# EAGLE design 05_ALU_OUT (EAGLE 7.5.0)
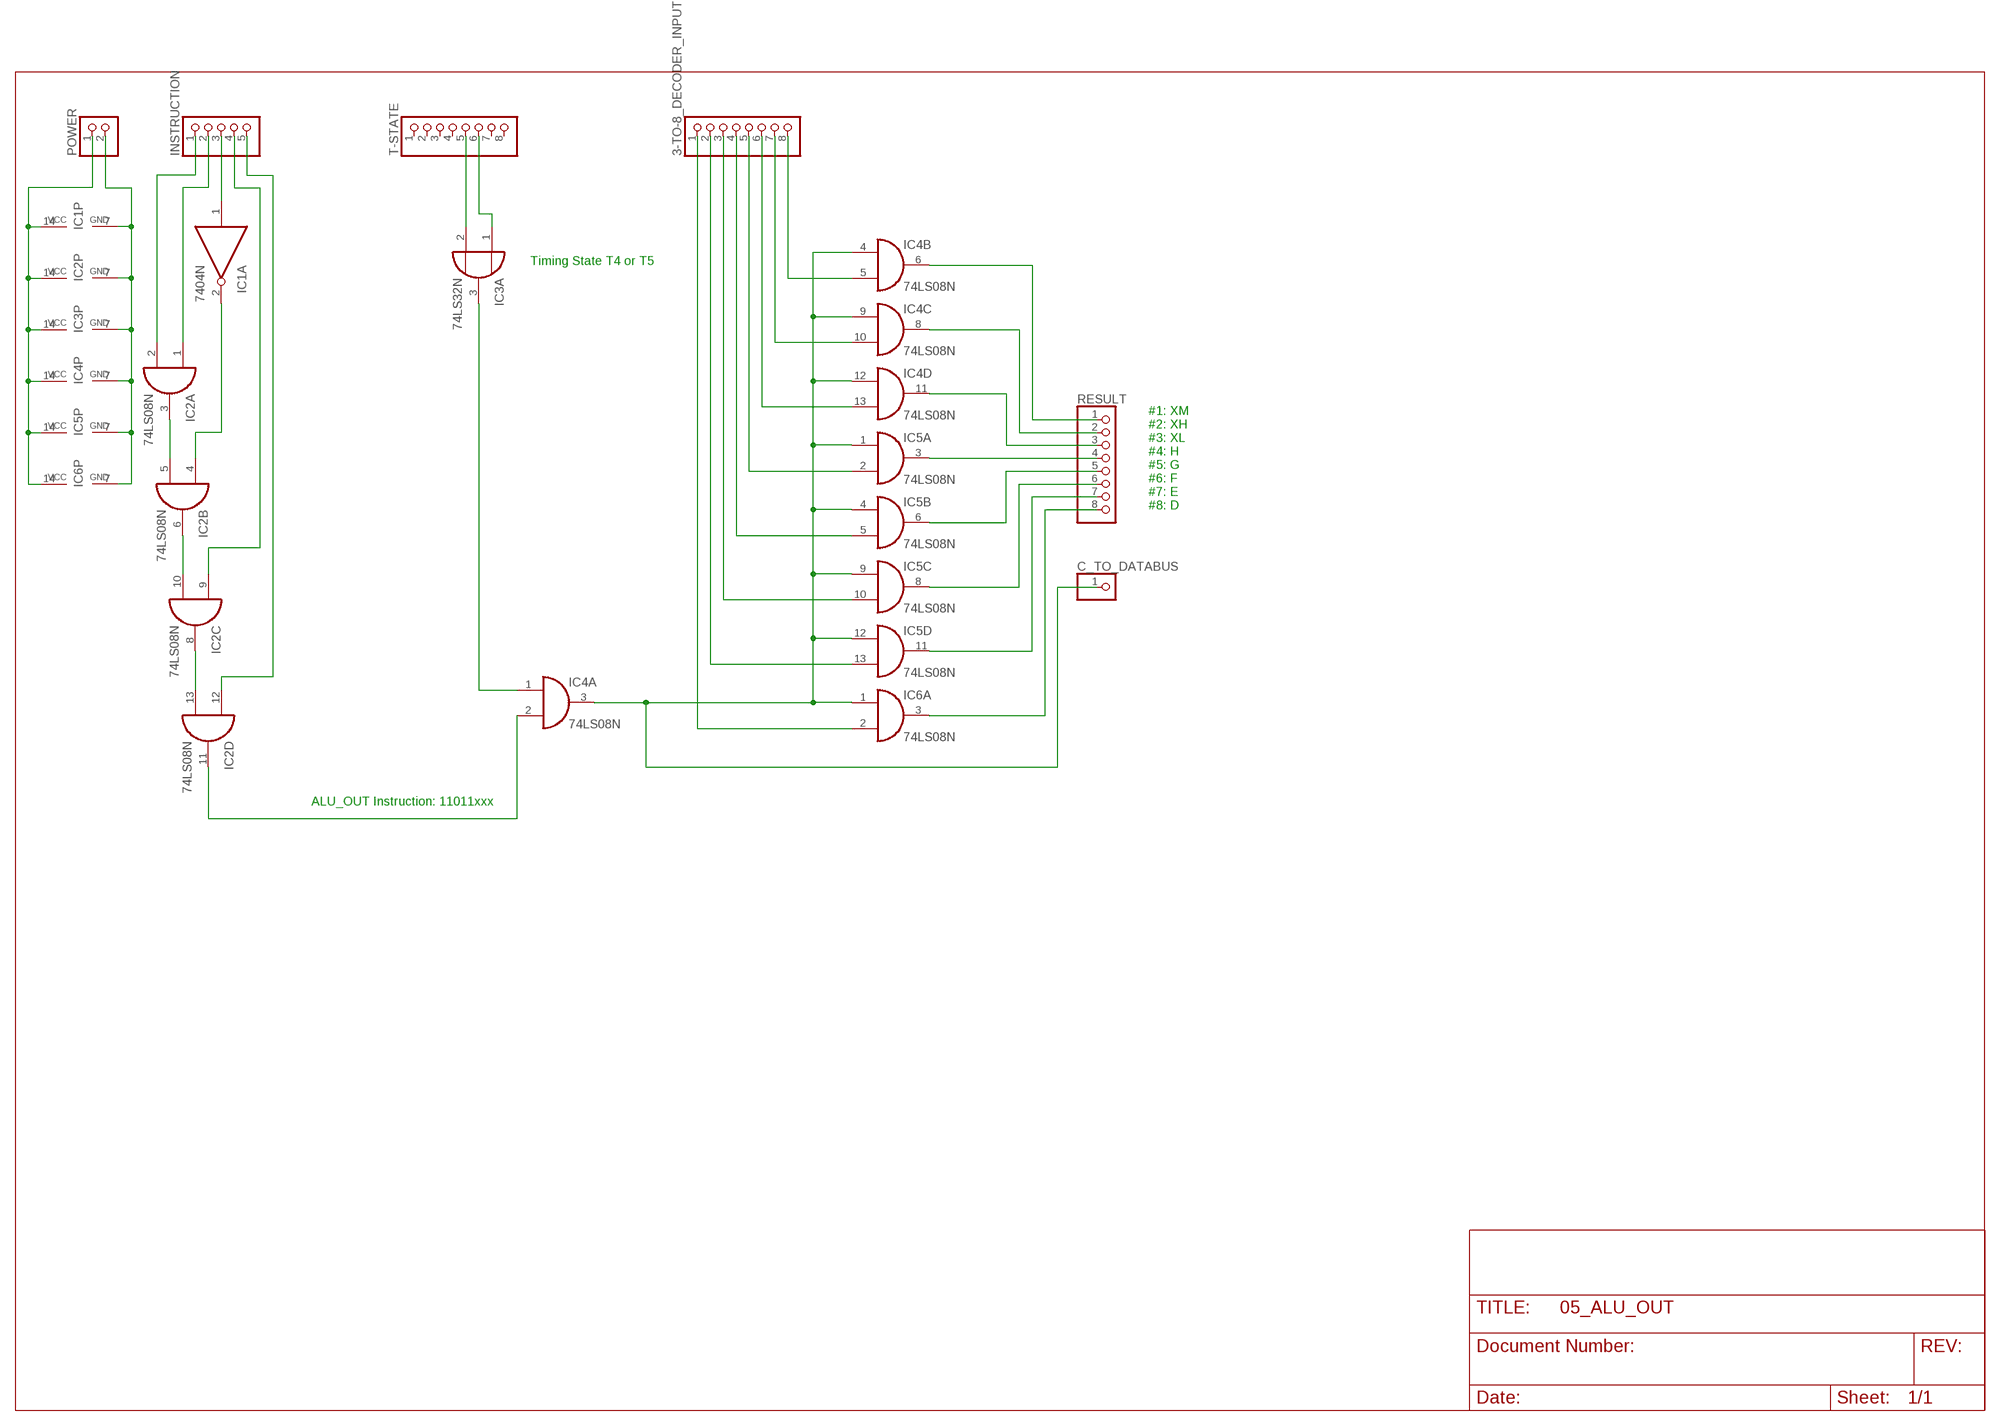
[diagram p0: schematic, sheet 1]

## Parts
3-TO-8_DECODER_INPUT  PINHD-1X8  [1X08]
C_TO_DATABUS  PINHD-1X1  [1X01]
IC1  7404N  [DIL14]
IC2  74LS08N  [DIL14]
IC3  74LS32N  [DIL14]
IC4  74LS08N  [DIL14]
IC5  74LS08N  [DIL14]
IC6  74LS08N  [DIL14]
INSTRUCTION  PINHD-1X5  [1X05]
POWER  PINHD-1X2  [1X02]
RESULT  PINHD-1X8  [1X08]
T-STATE  PINHD-1X8  [1X08]

## Nets
GND: IC1.7(P:GND) IC2.7(P:GND) IC3.7(P:GND) IC4.7(P:GND) IC5.7(P:GND) IC6.7(P:GND) POWER.2
N$1: IC1.1(A:I) INSTRUCTION.3
N$2: IC2.2(A:I1) INSTRUCTION.1
N$3: IC2.1(A:I0) INSTRUCTION.2
N$4: IC2.3(A:O) IC2.5(B:I1)
N$5: IC1.2(A:O) IC2.4(B:I0)
N$6: IC2.6(B:O) IC2.10(C:I1)
N$7: IC2.9(C:I0) INSTRUCTION.4
N$8: IC2.8(C:O) IC2.13(D:I1)
N$9: IC2.12(D:I0) INSTRUCTION.5
N$10: IC2.11(D:O) IC4.2(A:I1)
N$11: IC3.2(A:I1) T-STATE.5
N$12: IC3.1(A:I0) T-STATE.6
N$13: IC3.3(A:O) IC4.1(A:I0)
N$14: C_TO_DATABUS.1 IC4.3(A:O) IC4.4(B:I0) IC4.9(C:I0) IC4.12(D:I0) IC5.1(A:I0) IC5.4(B:I0) IC5.9(C:I0) IC5.12(D:I0) IC6.1(A:I0)
N$15: 3-TO-8_DECODER_INPUT.8 IC4.5(B:I1)
N$16: 3-TO-8_DECODER_INPUT.7 IC4.10(C:I1)
N$17: 3-TO-8_DECODER_INPUT.6 IC4.13(D:I1)
N$18: 3-TO-8_DECODER_INPUT.5 IC5.2(A:I1)
N$19: 3-TO-8_DECODER_INPUT.4 IC5.5(B:I1)
N$20: 3-TO-8_DECODER_INPUT.3 IC5.10(C:I1)
N$21: 3-TO-8_DECODER_INPUT.2 IC5.13(D:I1)
N$22: 3-TO-8_DECODER_INPUT.1 IC6.2(A:I1)
N$23: IC4.6(B:O) RESULT.1
N$24: IC4.8(C:O) RESULT.2
N$25: IC4.11(D:O) RESULT.3
N$26: IC5.3(A:O) RESULT.4
N$27: IC5.6(B:O) RESULT.5
N$28: IC5.8(C:O) RESULT.6
N$29: IC5.11(D:O) RESULT.7
N$30: IC6.3(A:O) RESULT.8
VCC: IC1.14(P:VCC) IC2.14(P:VCC) IC3.14(P:VCC) IC4.14(P:VCC) IC5.14(P:VCC) IC6.14(P:VCC) POWER.1
Unconnected: IC1.3(B:I) IC1.4(B:O) IC1.5(C:I) IC1.6(C:O) IC1.8(D:O) IC1.9(D:I) IC1.10(E:O) IC1.11(E:I) IC1.12(F:O) IC1.13(F:I) IC3.4(B:I0) IC3.5(B:I1) IC3.6(B:O) IC3.8(C:O) IC3.9(C:I0) IC3.10(C:I1) IC3.11(D:O) IC3.12(D:I0) IC3.13(D:I1) IC6.4(B:I0) IC6.5(B:I1) IC6.6(B:O) IC6.8(C:O) IC6.9(C:I0) IC6.10(C:I1) IC6.11(D:O) IC6.12(D:I0) IC6.13(D:I1) T-STATE.1 T-STATE.2 T-STATE.3 T-STATE.4 T-STATE.7 T-STATE.8

## Notes on the sheet
- Timing State T4 or T5
- #1: XM
  #2: XH
  #3: XL
  #4: H
  #5: G
  #6: F
  #7: E
  #8: D
- ALU_OUT Instruction: 11011xxx

## Library data of the parts
3-TO-8_DECODER_INPUT RESULT T-STATE = pinhead:PINHD-1X8: PIN HEADER
C_TO_DATABUS = pinhead:PINHD-1X1: PIN HEADER
IC1 = 74xx-eu:74*04: Hex INVERTER
IC2 IC4-IC6 = 74xx-eu:74*08: Quad 2-input AND gate
IC3 = 74xx-eu:74*32: Quad 2-input OR gate
INSTRUCTION = pinhead:PINHD-1X5: PIN HEADER
POWER = pinhead:PINHD-1X2: PIN HEADER

## Board
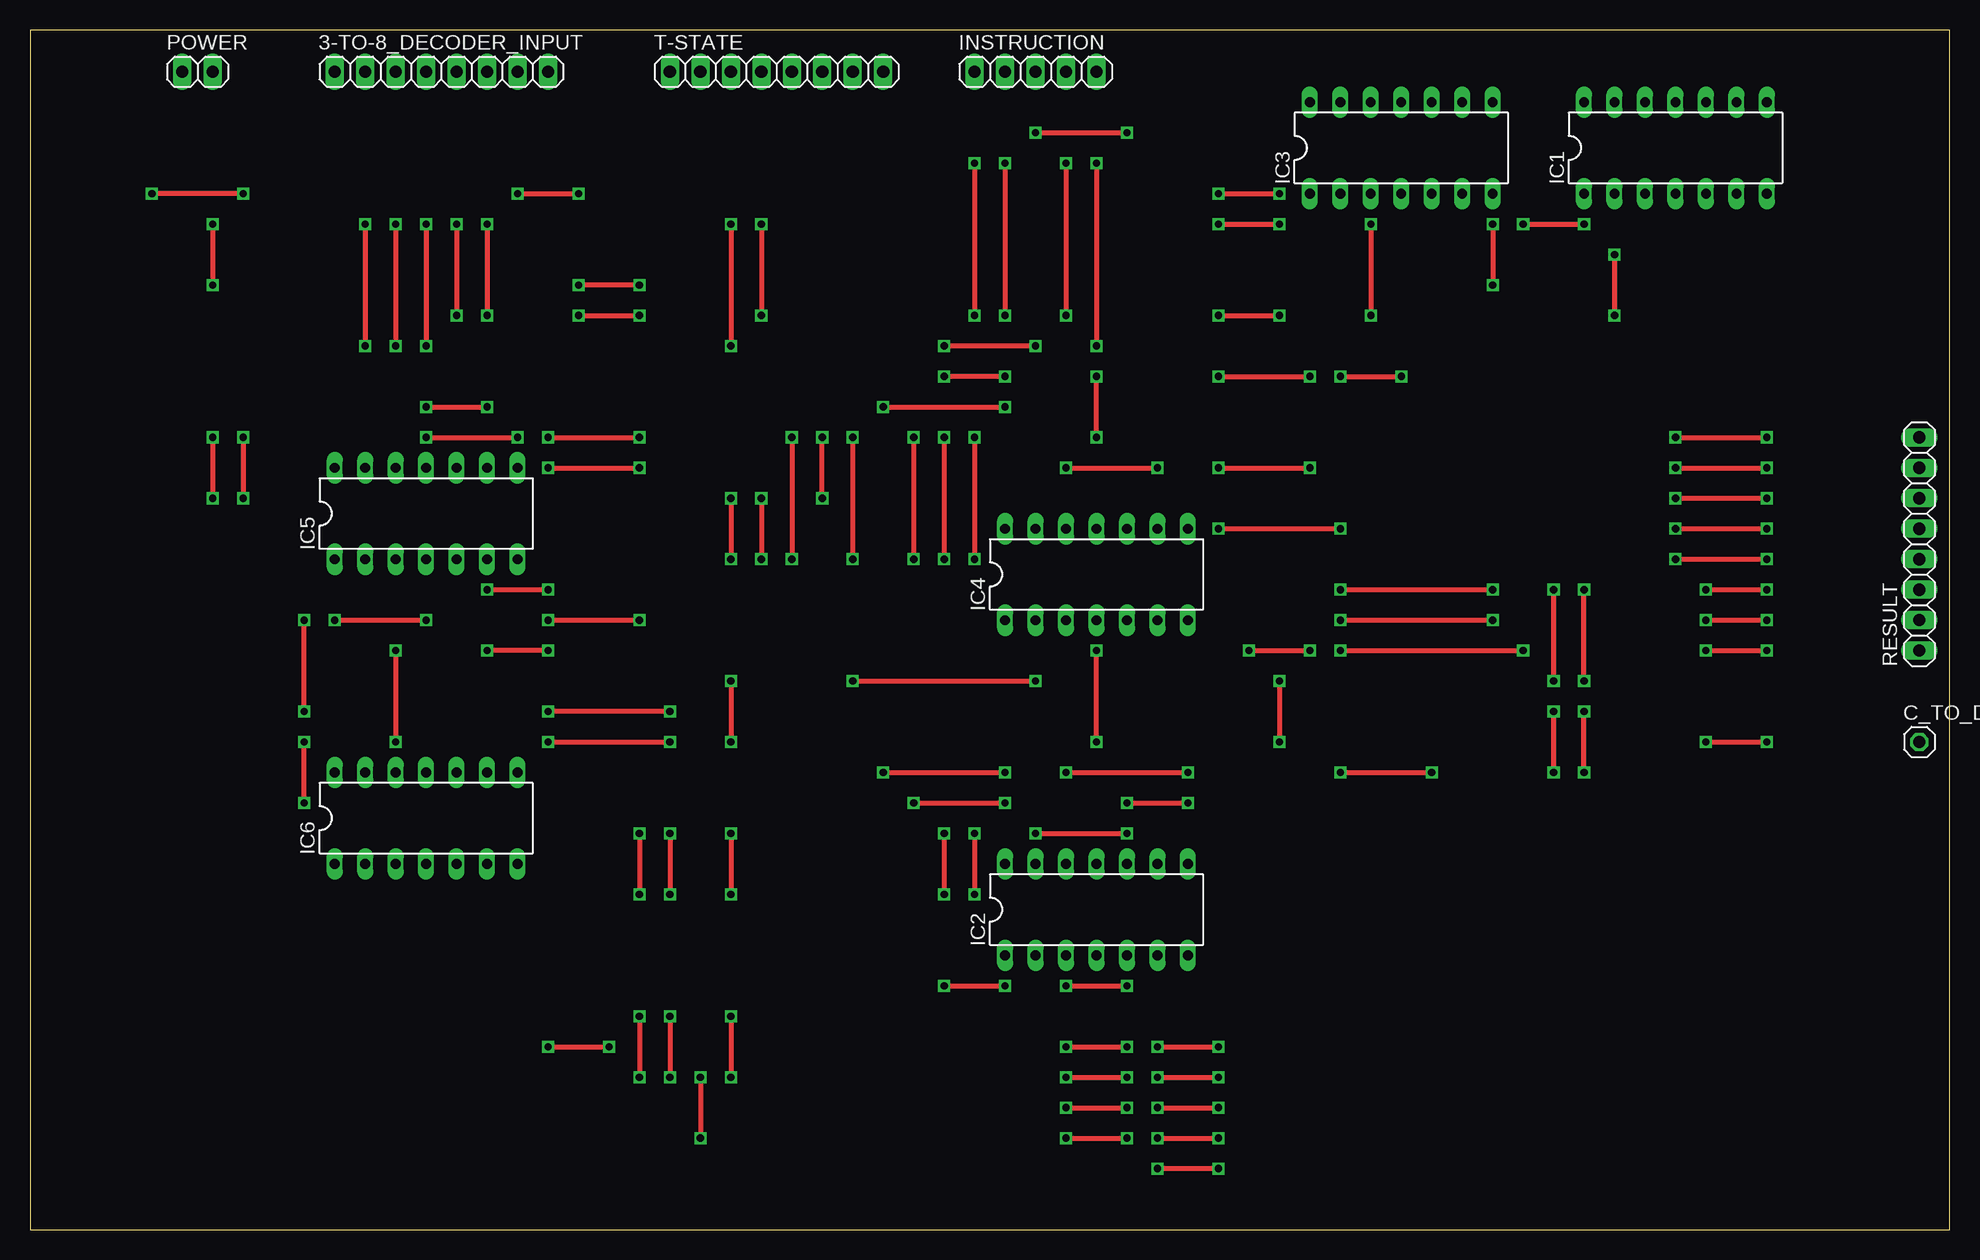
[diagram p1: board, top side]
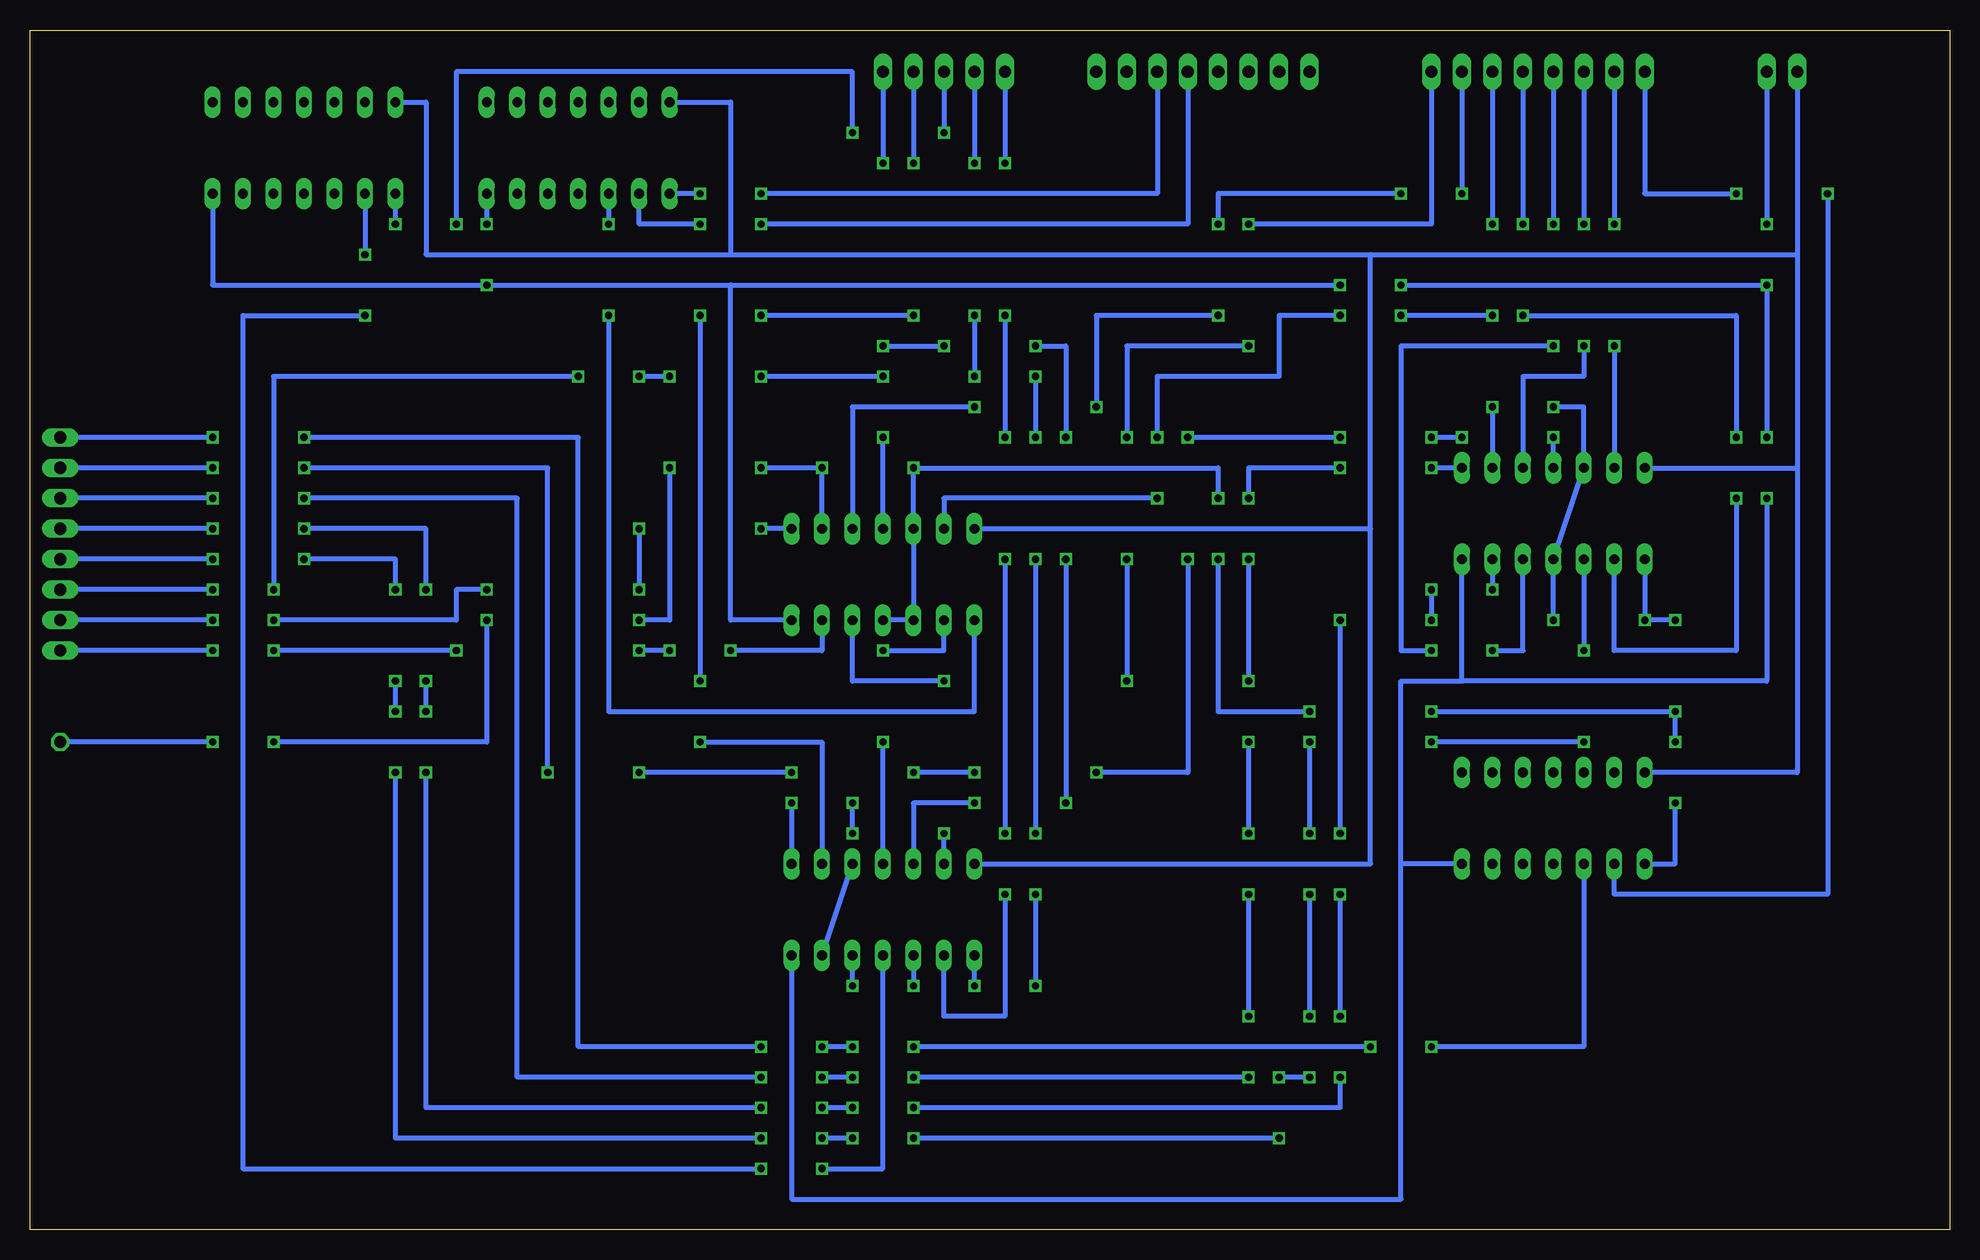
[diagram p2: board, bottom side, seen from below]

Size 160 x 100 mm. Coordinates in mm from the lower left corner, seen from the top.
Outline: 0,0 160,0 160,100 0,100 0,0
Copper layers (1*16): Top 0.035mm / dielectric 1.5mm / Bottom 0.035mm
Design rules "default": minimum track width 10mil, minimum drill 24mil, track to track 8mil, track to pad 8mil, pad to pad 8mil, via to via 8mil, smd to smd 8mil, copper to edge 40mil, drill to drill 8mil, minimum pad ring 10mil, minimum via ring 8mil, stop-mask expansion 4mil, vias tented up to drill 0mil, thermal gap 10mil

### Footprints (pad centres in the part's own frame; a part is rotated, then mirrored left to right if it is on the bottom)
1X08 = drill 1.016 long: 1 -8.89,0; 2 -6.35,0; 3 -3.81,0; 4 -1.27,0; 5 1.27,0; 6 3.81,0; 7 6.35,0; 8 8.89,0
1X01 = drill 1.016 octagon: 1 0,0
DIL14 = drill 0.813 long: 1 -7.62,-3.81; 2 -5.08,-3.81; 3 -2.54,-3.81; 4 0,-3.81; 5 2.54,-3.81; 6 5.08,-3.81; 7 7.62,-3.81; 8 7.62,3.81; 9 5.08,3.81; 10 2.54,3.81; 11 0,3.81; 12 -2.54,3.81; 13 -5.08,3.81; 14 -7.62,3.81
1X05 = drill 1.016 long: 1 -5.08,0; 2 -2.54,0; 3 0,0; 4 2.54,0; 5 5.08,0
1X02 = drill 1.016 long: 1 -1.27,0; 2 1.27,0

### Placement (x,y rotation side)
3-TO-8_DECODER_INPUT  34.29,96.52 0 top
C_TO_DATABUS  157.48,40.64 0 top
IC1  137.16,90.17 0 top
IC2  88.9,26.67 0 top
IC3  114.3,90.17 0 top
IC4  88.9,54.61 0 top
IC5  33.02,59.69 0 top
IC6  33.02,34.29 0 top
INSTRUCTION  83.82,96.52 0 top
POWER  13.97,96.52 0 top
RESULT  157.48,57.15 90 top
T-STATE  62.23,96.52 0 top

### Tracks (layer width: path | path; a pad name or v marks a point on that pad's centre or on a via)
GND  (via drill 0.6)
  Top 0.406: v15.24,83.82 v15.24,78.74 | v15.24,66.04 v15.24,60.96 | v121.92,83.82 v121.92,78.74 | v50.8,78.74 v45.72,78.74
  Bottom 0.406: POWER.2 v15.24,83.82 | v15.24,66.04 v15.24,78.74 v45.72,78.74 | v15.24,60.96 15.24,45.72 40.64,45.72 | 40.64,45.72 IC5.7 | IC6.7 45.72,30.48 | 45.72,30.48 45.72,45.72 40.64,45.72 | IC2.7 96.52,2.54 45.72,2.54 45.72,30.48 | IC3.7 v121.92,83.82 | 101.6,78.74 v121.92,78.74 144.78,78.74 IC1.7 | 101.6,78.74 v50.8,78.74 | IC4.7 101.6,50.8 101.6,78.74
N$1  (via drill 0.6)
  Top 0.406: v83.82,91.44 v91.44,91.44 | v124.46,83.82 v129.54,83.82
  Bottom 0.406: INSTRUCTION.3 v83.82,91.44 | v91.44,91.44 91.44,96.52 124.46,96.52 v124.46,83.82 | v129.54,83.82 IC1.1
N$2  (via drill 0.6)
  Top 0.406: v78.74,88.9 v78.74,76.2 | v78.74,66.04 v78.74,55.88 | v78.74,33.02 v78.74,27.94
  Bottom 0.406: INSTRUCTION.1 v78.74,88.9 | v78.74,76.2 v78.74,66.04 | v78.74,55.88 v78.74,33.02 | v78.74,27.94 78.74,17.78 83.82,17.78 IC2.2
N$3  (via drill 0.6)
  Top 0.406: v81.28,88.9 v81.28,76.2 | v81.28,71.12 v76.2,71.12 | v76.2,66.04 v76.2,55.88 | v76.2,33.02 v76.2,27.94 | v76.2,20.32 v81.28,20.32
  Bottom 0.406: INSTRUCTION.2 v81.28,88.9 | v81.28,76.2 v81.28,71.12 | v76.2,71.12 v76.2,66.04 | v76.2,55.88 v76.2,33.02 | v76.2,27.94 v76.2,20.32 | v81.28,20.32 IC2.1
N$4  (via drill 0.6)
  Top 0.406: v86.36,20.32 v91.44,20.32
  Bottom 0.406: IC2.3 v86.36,20.32 | v91.44,20.32 IC2.5
N$5  (via drill 0.6)
  Top 0.406: v132.08,81.28 v132.08,76.2 | v99.06,5.08 v93.98,5.08
  Bottom 0.406: IC1.2 v132.08,81.28 | v99.06,5.08 142.24,5.08 142.24,76.2 v132.08,76.2 | v93.98,5.08 88.9,5.08 IC2.4
N$6
  Bottom 0.406: IC2.6 IC2.10
N$7  (via drill 0.6)
  Top 0.406: v86.36,88.9 v86.36,76.2 | v99.06,76.2 v104.14,76.2 | v104.14,45.72 v104.14,40.64
  Bottom 0.406: INSTRUCTION.4 v86.36,88.9 | v86.36,76.2 v99.06,76.2 | v104.14,76.2 v104.14,45.72 | v104.14,40.64 93.98,40.64 IC2.9
N$8  (via drill 0.6)
  Top 0.406: v83.82,33.02 v91.44,33.02 | v91.44,35.56 v96.52,35.56
  Bottom 0.406: IC2.13 v83.82,33.02 | v91.44,33.02 v91.44,35.56 | v96.52,35.56 IC2.8
N$9  (via drill 0.6)
  Top 0.406: v88.9,88.9 v88.9,73.66 | v83.82,73.66 v76.2,73.66 | v73.66,66.04 v73.66,55.88 | v73.66,35.56 v81.28,35.56
  Bottom 0.406: INSTRUCTION.5 v88.9,88.9 | v88.9,73.66 v83.82,73.66 | v76.2,73.66 73.66,73.66 v73.66,66.04 | v73.66,55.88 v73.66,35.56 | v81.28,35.56 86.36,35.56 IC2.12
N$10  (via drill 0.6)
  Top 0.406: v88.9,40.64 v88.9,48.26
  Bottom 0.406: IC2.11 v88.9,40.64 | v88.9,48.26 83.82,48.26 IC4.2
N$11  (via drill 0.6)
  Top 0.406: v99.06,83.82 v104.14,83.82
  Bottom 0.406: T-STATE.5 63.5,83.82 v99.06,83.82 | v104.14,83.82 109.22,83.82 IC3.2
N$12  (via drill 0.6)
  Top 0.406: v99.06,86.36 v104.14,86.36
  Bottom 0.406: T-STATE.6 66.04,86.36 v99.06,86.36 | v104.14,86.36 IC3.1
N$13  (via drill 0.6)
  Top 0.406: v111.76,83.82 v111.76,76.2
  Bottom 0.406: IC3.3 v111.76,83.82 | v111.76,76.2 111.76,43.18 81.28,43.18 IC4.1
N$14  (via drill 0.6)
  Top 0.406: v33.02,68.58 v38.1,68.58 | v25.4,50.8 v33.02,50.8 | v22.86,35.56 v22.86,40.64 | v22.86,43.18 v22.86,50.8 | v86.36,63.5 v93.98,63.5 | v60.96,60.96 v60.96,55.88 | v53.34,43.18 v43.18,43.18 | v99.06,63.5 v106.68,63.5 | v109.22,50.8 v121.92,50.8 | v139.7,40.64 v144.78,40.64
  Bottom 0.406: v33.02,68.58 30.48,68.58 IC5.12 IC5.4 v33.02,50.8 | v38.1,68.58 IC5.9 | IC5.1 v25.4,50.8 v22.86,50.8 | IC6.1 22.86,30.48 v22.86,35.56 | v22.86,40.64 v22.86,43.18 v43.18,43.18 | IC4.4 IC4.3 IC4.12 v86.36,63.5 60.96,63.5 v60.96,60.96 | v60.96,55.88 60.96,43.18 v53.34,43.18 | IC4.9 v93.98,63.5 v99.06,63.5 | v106.68,63.5 106.68,50.8 v109.22,50.8 | v121.92,50.8 121.92,40.64 v139.7,40.64 | v144.78,40.64 C_TO_DATABUS.1
N$15  (via drill 0.6)
  Top 0.406: v58.42,83.82 v58.42,73.66 | v68.58,66.04 v68.58,55.88 | v68.58,45.72 v83.82,45.72
  Bottom 0.406: 3-TO-8_DECODER_INPUT.8 43.18,83.82 v58.42,83.82 | v58.42,73.66 68.58,73.66 v68.58,66.04 | v68.58,55.88 v68.58,45.72 | v83.82,45.72 91.44,45.72 IC4.5
N$16  (via drill 0.6)
  Top 0.406: v40.64,86.36 v45.72,86.36 | v60.96,83.82 v60.96,76.2 | v71.12,68.58 v81.28,68.58
  Bottom 0.406: 3-TO-8_DECODER_INPUT.7 v40.64,86.36 | v45.72,86.36 60.96,86.36 v60.96,83.82 | v60.96,76.2 71.12,76.2 v71.12,68.58 | v81.28,68.58 91.44,68.58 IC4.10
N$17  (via drill 0.6)
  Top 0.406: v38.1,83.82 v38.1,76.2 | v45.72,76.2 v50.8,76.2 | v66.04,60.96 v66.04,66.04
  Bottom 0.406: 3-TO-8_DECODER_INPUT.6 v38.1,83.82 | v38.1,76.2 v45.72,76.2 | v50.8,76.2 55.88,76.2 55.88,71.12 66.04,71.12 v66.04,66.04 | v66.04,60.96 83.82,60.96 IC4.13
N$18  (via drill 0.6)
  Top 0.406: v35.56,83.82 v35.56,76.2 | v17.78,66.04 v17.78,60.96
  Bottom 0.406: 3-TO-8_DECODER_INPUT.5 v35.56,83.82 | v35.56,76.2 17.78,76.2 v17.78,66.04 | v17.78,60.96 17.78,48.26 27.94,48.26 IC5.2
N$19  (via drill 0.6)
  Top 0.406: v33.02,83.82 v33.02,73.66 | v43.18,48.26 v38.1,48.26
  Bottom 0.406: 3-TO-8_DECODER_INPUT.4 v33.02,83.82 | v33.02,73.66 45.72,73.66 45.72,48.26 v43.18,48.26 | v38.1,48.26 35.56,48.26 IC5.5
N$20  (via drill 0.6)
  Top 0.406: v30.48,83.82 v30.48,73.66
  Bottom 0.406: 3-TO-8_DECODER_INPUT.3 v30.48,83.82 | v30.48,73.66 30.48,71.12 35.56,71.12 IC5.10
N$21  (via drill 0.6)
  Top 0.406: v27.94,83.82 v27.94,73.66
  Bottom 0.406: 3-TO-8_DECODER_INPUT.2 v27.94,83.82 | v27.94,73.66 IC5.13
N$22  (via drill 0.6)
  Top 0.406: v17.78,86.36 v10.16,86.36
  Bottom 0.406: 3-TO-8_DECODER_INPUT.1 25.4,86.36 v17.78,86.36 | v10.16,86.36 10.16,27.94 27.94,27.94 IC6.2
N$23  (via drill 0.6)
  Top 0.406: v101.6,48.26 v106.68,48.26 | v109.22,48.26 v124.46,48.26 | v139.7,48.26 v144.78,48.26
  Bottom 0.406: IC4.6 93.98,48.26 v101.6,48.26 | v106.68,48.26 v109.22,48.26 | v124.46,48.26 v139.7,48.26 | v144.78,48.26 RESULT.1
N$24  (via drill 0.6)
  Top 0.406: v99.06,58.42 v109.22,58.42 | v109.22,53.34 v121.92,53.34 | v139.7,50.8 v144.78,50.8
  Bottom 0.406: IC4.8 v99.06,58.42 | v109.22,58.42 v109.22,53.34 | v121.92,53.34 124.46,53.34 124.46,50.8 v139.7,50.8 | v144.78,50.8 RESULT.2
N$25  (via drill 0.6)
  Top 0.406: v88.9,66.04 v88.9,71.12 | v99.06,71.12 v106.68,71.12 | v109.22,71.12 v114.3,71.12 | v139.7,53.34 v144.78,53.34
  Bottom 0.406: IC4.11 v88.9,66.04 | v88.9,71.12 v99.06,71.12 | v106.68,71.12 v109.22,71.12 | v114.3,71.12 139.7,71.12 v139.7,53.34 | v144.78,53.34 RESULT.3
N$26  (via drill 0.6)
  Top 0.406: v30.48,48.26 v30.48,40.64 | v43.18,40.64 v53.34,40.64 | v53.34,33.02 v53.34,27.94 | v53.34,17.78 v53.34,12.7 | v55.88,12.7 v55.88,7.62 | v86.36,7.62 v91.44,7.62 | v93.98,7.62 v99.06,7.62 | v129.54,38.1 v129.54,43.18 | v129.54,45.72 v129.54,53.34 | v137.16,55.88 v144.78,55.88
  Bottom 0.406: IC5.3 v30.48,48.26 | v30.48,40.64 v43.18,40.64 | v53.34,40.64 v53.34,33.02 | v53.34,27.94 v53.34,17.78 | v53.34,12.7 v55.88,12.7 | v55.88,7.62 v86.36,7.62 | v91.44,7.62 v93.98,7.62 | v99.06,7.62 129.54,7.62 v129.54,38.1 | v129.54,43.18 v129.54,45.72 | v129.54,53.34 129.54,55.88 v137.16,55.88 | v144.78,55.88 RESULT.4
N$27  (via drill 0.6)
  Top 0.406: v38.1,53.34 v43.18,53.34 | v43.18,50.8 v50.8,50.8 | v50.8,33.02 v50.8,27.94 | v50.8,17.78 v50.8,12.7 | v86.36,10.16 v91.44,10.16 | v93.98,10.16 v99.06,10.16 | v127,38.1 v127,43.18 | v127,45.72 v127,53.34 | v137.16,58.42 v144.78,58.42
  Bottom 0.406: IC5.6 v38.1,53.34 | v43.18,53.34 v43.18,50.8 | v50.8,50.8 v50.8,33.02 | v50.8,27.94 v50.8,17.78 | v50.8,12.7 50.8,10.16 v86.36,10.16 | v91.44,10.16 v93.98,10.16 | v99.06,10.16 127,10.16 v127,38.1 | v127,43.18 v127,45.72 | v127,53.34 127,58.42 v137.16,58.42 | v144.78,58.42 RESULT.5
N$28  (via drill 0.6)
  Top 0.406: v43.18,63.5 v50.8,63.5 | v58.42,60.96 v58.42,55.88 | v58.42,45.72 v58.42,40.64 | v58.42,33.02 v58.42,27.94 | v58.42,17.78 v58.42,12.7 | v86.36,12.7 v91.44,12.7 | v93.98,12.7 v99.06,12.7 | v137.16,60.96 v144.78,60.96
  Bottom 0.406: IC5.8 v43.18,63.5 | v50.8,63.5 58.42,63.5 v58.42,60.96 | v58.42,55.88 v58.42,45.72 | v58.42,40.64 v58.42,33.02 | v58.42,27.94 v58.42,17.78 | v58.42,12.7 v86.36,12.7 | v91.44,12.7 v93.98,12.7 | v99.06,12.7 119.38,12.7 119.38,60.96 v137.16,60.96 | v144.78,60.96 RESULT.6
N$29  (via drill 0.6)
  Top 0.406: v33.02,66.04 v40.64,66.04 | v43.18,66.04 v50.8,66.04 | v63.5,66.04 v63.5,55.88 | v71.12,38.1 v81.28,38.1 | v86.36,38.1 v96.52,38.1 | v109.22,38.1 v116.84,38.1 | v137.16,63.5 v144.78,63.5
  Bottom 0.406: IC5.11 v33.02,66.04 | v40.64,66.04 v43.18,66.04 | v50.8,66.04 v63.5,66.04 | v63.5,55.88 63.5,38.1 v71.12,38.1 | v81.28,38.1 v86.36,38.1 | v96.52,38.1 v109.22,38.1 | v116.84,38.1 116.84,63.5 v137.16,63.5 | v144.78,63.5 RESULT.7
N$30  (via drill 0.6)
  Top 0.406: v43.18,15.24 v48.26,15.24 | v86.36,15.24 v91.44,15.24 | v93.98,15.24 v99.06,15.24 | v137.16,66.04 v144.78,66.04
  Bottom 0.406: IC6.3 30.48,15.24 v43.18,15.24 | v48.26,15.24 v86.36,15.24 | v91.44,15.24 v93.98,15.24 | v99.06,15.24 114.3,15.24 114.3,66.04 v137.16,66.04 | v144.78,66.04 RESULT.8
VCC
  Bottom 0.406: POWER.1 12.7,81.28 | 12.7,81.28 12.7,63.5 | 12.7,63.5 12.7,38.1 IC6.14 | IC5.14 12.7,63.5 | IC4.14 48.26,58.42 | 48.26,58.42 48.26,81.28 | 48.26,81.28 12.7,81.28 | IC2.14 48.26,30.48 48.26,58.42 | IC3.14 101.6,93.98 101.6,81.28 | 101.6,81.28 48.26,81.28 | IC1.14 127,93.98 127,81.28 101.6,81.28